# Altium schematic sheet ANYA_2620_PROJECT.SchDoc
size A4; SheetNumber: 1; SheetTotal: 5
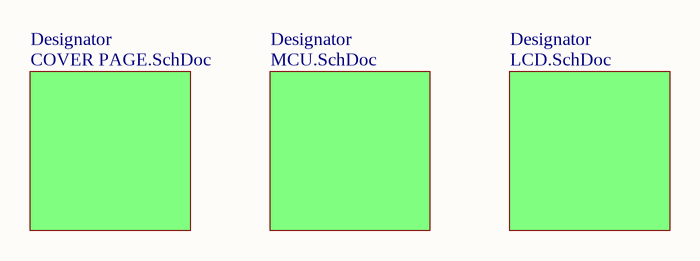
[diagram p0: ANYA_2620_PROJECT.SchDoc]

## Sub-sheets
Designator = COVER PAGE.SchDoc: no entries
Designator = MCU.SchDoc: no entries
Designator = LCD.SchDoc: no entries